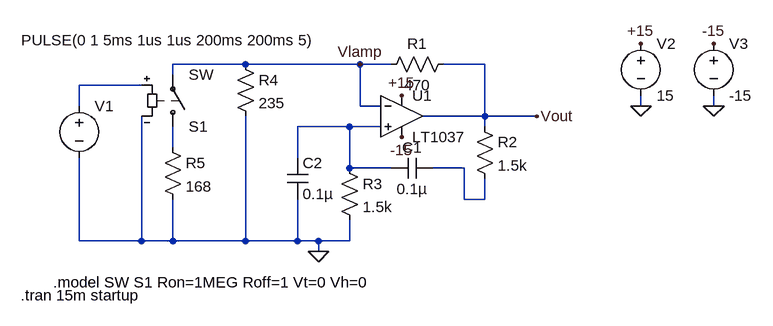
[diagram p0: schematic Lamp.asc]
Lamp.asc, the LTspice schematic file:
Version 4
SHEET 1 880 680
WIRE -16 64 -128 64
WIRE 160 64 -16 64
WIRE 208 64 160 64
WIRE 352 64 288 64
WIRE -128 80 -128 64
WIRE -176 96 -272 96
WIRE -272 128 -272 96
WIRE 160 128 160 64
WIRE 192 128 160 128
WIRE 592 128 592 112
WIRE 704 128 704 112
WIRE 352 144 352 64
WIRE 352 144 256 144
WIRE 432 144 352 144
WIRE 144 160 64 160
WIRE 192 160 144 160
WIRE 352 160 352 144
WIRE -128 192 -128 160
WIRE 64 208 64 160
WIRE 144 224 144 160
WIRE 208 224 144 224
WIRE 320 224 272 224
WIRE 320 272 320 224
WIRE 352 272 352 240
WIRE 352 272 320 272
WIRE -272 336 -272 208
WIRE -176 336 -176 144
WIRE -176 336 -272 336
WIRE -128 336 -128 272
WIRE -128 336 -176 336
WIRE -16 336 -16 144
WIRE -16 336 -128 336
WIRE 64 336 64 272
WIRE 64 336 -16 336
WIRE 96 336 64 336
WIRE 144 336 144 304
WIRE 144 336 96 336
WIRE 96 352 96 336
FLAG 96 352 0
FLAG 592 128 0
FLAG 704 128 0
FLAG 592 32 +15
FLAG 224 112 +15
FLAG 224 176 -15
FLAG 704 32 -15
FLAG 432 144 Vout
FLAG 160 64 Vlamp
SYMBOL Opamps\\LT1037 224 80 R0
SYMATTR InstName U1
SYMBOL res 192 80 R270
WINDOW 0 32 56 VTop 2
WINDOW 3 0 56 VBottom 2
SYMATTR InstName R1
SYMATTR Value 470
SYMBOL res 336 144 R0
SYMATTR InstName R2
SYMATTR Value 1.5k
SYMBOL res 128 208 R0
SYMATTR InstName R3
SYMATTR Value 1.5k
SYMBOL res -32 48 R0
SYMATTR InstName R4
SYMATTR Value 235
SYMBOL res -144 176 R0
SYMATTR InstName R5
SYMATTR Value 168
SYMBOL cap 272 208 R90
WINDOW 0 0 32 VBottom 2
WINDOW 3 32 32 VTop 2
SYMATTR InstName C1
SYMATTR Value 0.1µ
SYMBOL cap 48 208 R0
SYMATTR InstName C2
SYMATTR Value 0.1µ
SYMBOL sw -128 176 M180
SYMATTR InstName S1
SYMBOL voltage -272 112 R0
WINDOW 3 -89 -85 Left 2
WINDOW 123 0 0 Left 2
WINDOW 39 0 0 Left 2
SYMATTR InstName V1
SYMATTR Value PULSE(0 1 5ms 1us 1us 200ms 200ms 5)
SYMBOL voltage 592 16 R0
SYMATTR InstName V2
SYMATTR Value 15
SYMBOL voltage 704 16 R0
SYMATTR InstName V3
SYMATTR Value -15
TEXT -312 400 Left 2 !.model SW S1 Ron=1MEG Roff=1 Vt=0 Vh=0
TEXT -362 420 Left 2 !.tran 15m startup

The netlist it stands for:
* Lamp.asc
XU1 N002 Vlamp +15 -15 Vout LT1037  ; pins In+ In- V+ V- OUT
R1 Vlamp Vout 470
R2 Vout N004 1.5k
R3 N002 0 1.5k
R4 Vlamp 0 235
R5 N003 0 168
C1 N004 N002 0.1µ
C2 N002 0 0.1µ
S1 N003 Vlamp N001 0 SW
V1 N001 0 PULSE(0 1 5ms 1us 1us 200ms 200ms 5)
V2 +15 0 15
V3 -15 0 -15
.model SW S1 Ron=1MEG Roff=1 Vt=0 Vh=0
.tran 15m startup
.backanno
.end